# Altium schematic sheet Sheet2.SchDoc
size A; SheetNumber: 2; SheetTotal: 2
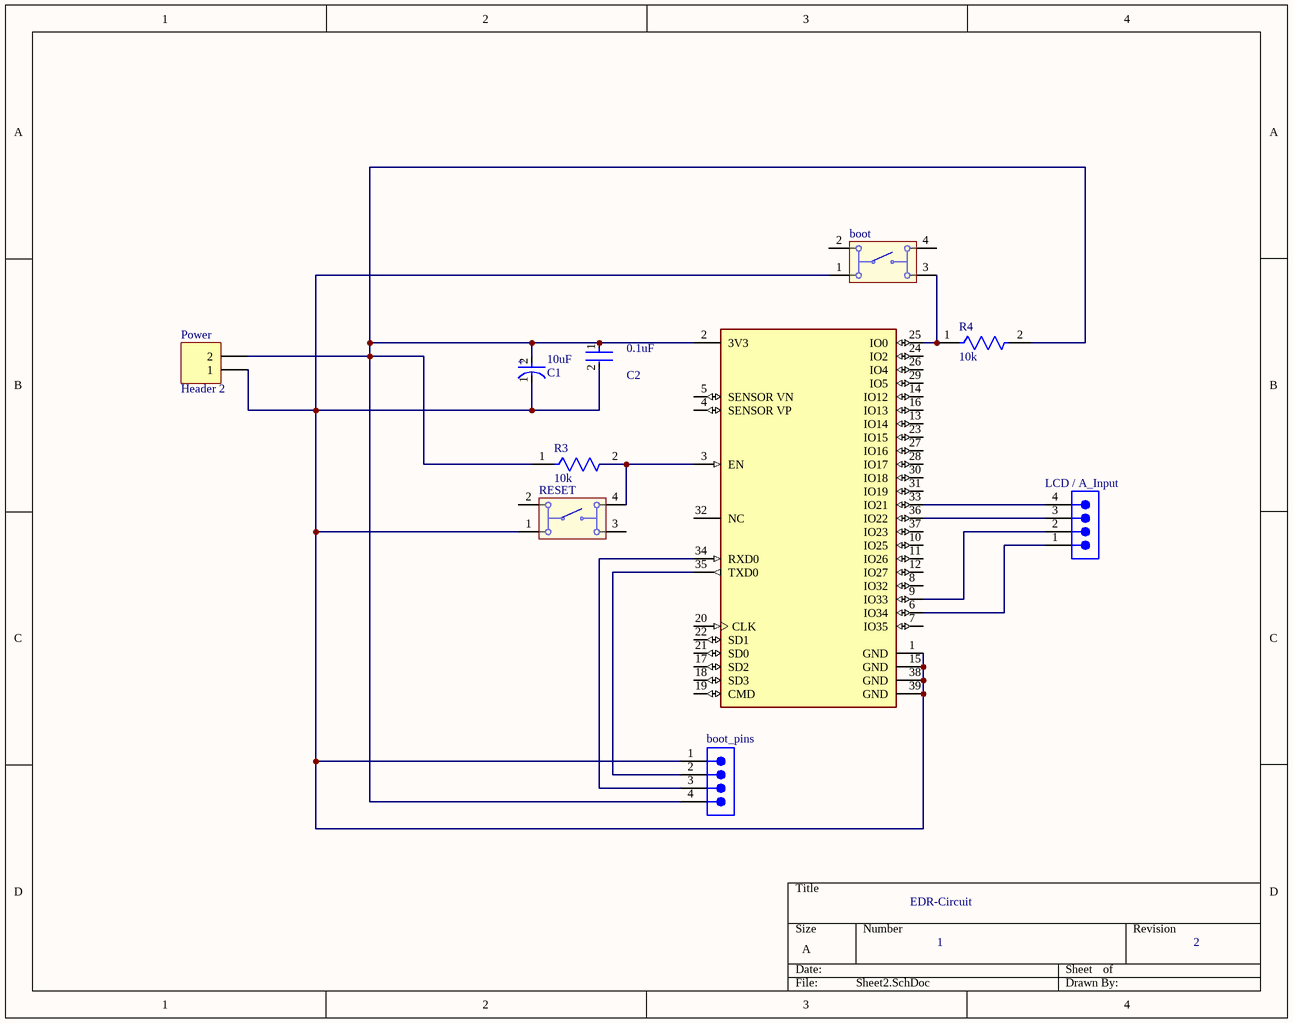
[diagram p0: Sheet2.SchDoc]

## Parts
0.1uF  C2  [FP-RCE0DB-MFG]
10uF  C1  [FP-RAD-TH-D_10_0_5-L_16_1-MFG]
boot  430471025826  [430471025826]  (value not drawn)
boot_pins  TSW-104-08-L-S  [SMTC-TSW-104-08-X-S]  (value not drawn)
esp32  ESP32-WROOM-32D  [FP-ESP32-WROOM-32D-MFG]  (value not drawn)
LCD_/_A_Input  TSW-104-08-L-S  [SMTC-TSW-104-08-X-S]  (value not drawn)
Power  Header 2  [HDR1X2]
R3  10k  [FP-MBB0207-MFG]
R4  10k  [FP-MBB0207-MFG]
RESET  430471025826  [430471025826]  (value not drawn)

## Nets
Net0.1uF_1: 0.1uF.1 10uF.2(A) boot_pins.4 esp32.2(3V3) Power.2 R3.1 R4.2
Net0.1uF_2: 0.1uF.2 10uF.1(C) boot.1 boot_pins.1 esp32.1(GND) esp32.15(GND) esp32.38(GND) esp32.39(GND) Power.1 RESET.1
Netboot_3: boot.3 esp32.25(IO0) R4.1
Netboot_pins_2: boot_pins.2 esp32.35(TXD0)
Netboot_pins_3: boot_pins.3 esp32.34(RXD0)
Netesp32_3: esp32.3(EN) R3.2 RESET.4
Netesp32_6: esp32.6(IO34) LCD_/_A_Input.1
Netesp32_9: esp32.9(IO33) LCD_/_A_Input.2
Netesp32_33: esp32.33(IO21) LCD_/_A_Input.4
Netesp32_36: esp32.36(IO22) LCD_/_A_Input.3

Not connected (* = marked no-connect by the designer): boot 2 4; esp32 4(SENSOR_VP) 5(SENSOR_VN) 7(IO35) 8(IO32) 10(IO25) 11(IO26) 12(IO27) 13(IO14) 14(IO12) 16(IO13) 17(SD2) 18(SD3) 19(CMD) 20(CLK) 21(SD0) 22(SD1) 23(IO15) 24(IO2) 26(IO4) 27(IO16) 28(IO17) 29(IO5) 30(IO18) 31(IO19) 32(NC) 37(IO23); RESET 2 3

## Notes on the sheet
- EDR-Circuit
- 1
- 2
- (in symbol CMP-05427-000979-1) +

## Library data of the parts
0.1uF = CMP-06035-048089-1: Cap Ceramic 100nF 50V X7R ±10% Radial 2.5mm +125°C Ammo Pack; Lead/Base Style: Straight; Lead Diameter: 0.5mm; Height: 3.5mm; Lead Pitch: 0.098inch; Case/Package: Radial; Height - Seated (Max): 0.138inch; Dielectric: X7R; Min Operating Temperature: -55°C; Tolerance: 10%; Max Operating Temperature: 125°C; Mount: Through Hole; Package Quantity: 2000; Voltage Rating: 50V; Lead Free: Lead Free; Capacitance: 100nF; Termination: Radial; Width: 0.098inch; Resistor Type: Ceramic; Voltage Rating (DC): 50V; Ratings: AEC-Q200; Length: 0.142inch; Packaging: Tape and Reel
10uF = CMP-05427-000979-1: Aluminum Electrolytic Capacitors (Radial Lead Type) AEC-Q200 Qualified 1000uF ±20% 10V; Leakage Current: 3uA; Lead Diameter: 0.6mm; Ripple Current: 1.05A; ESR (Equivalent Series Resistance): 68mR; Life (Hours): 3000Hour; Capacitance: 1mF; Dielectric Material: Aluminium; Packaging: Bulk; Lead Free: Lead Free; Min Operating Temperature: -55°C; Case/Package: Radial; Mount: Through Hole; Termination: Radial; Voltage: 10V; Height: 16mm; Lead Pitch: 5mm; RoHS Compliant: Yes; Voltage Rating (DC): 10V; Length: 16mm; Package Quantity: 200; Max Operating Temperature: 105°C; Ratings: AEC-Q200; Radiation Hardening: No; Contact Plating: Tin; Size: 16mm; Height - Seated (Max): 0.63inch; Diameter: 10mm; REACH SVHC: No SVHC; Series: FC; Construction: RADIAL; Voltage Rating: 10V; Tolerance: 20%; Impedance: 68mR
boot RESET = CMP-1452-00022-1: WS-TASV SMD Tact Switch 6X6 mm; Manufacturer: Wuerth Elektronik; NoPins: 04; ComponentLink1Description: Manufacturer URL; PackageReference: 430471025826; ComponentLink2Description: Datasheet; ComponentLink2URL: http://katalog.we-online.de/em/datasheet/4304x1.pdf; ComponentLink1URL: http://www.we-online.com; PartNumber: 430471025826
boot_pins LCD_/_A_Input = CMP-1024-00358-1: 0.025" SQ Post Header, Through-hole, Vertical, -55 to 125 degC, 2.54 mm Pitch, 4-Pin, Male, RoHS; Manufacturer: Samtec; Pitch: 2.54 mm; PartNumber: TSW-104-08-L-S; RoHS: True; Temperature Range: -55 to 125 degC; PackageDescription: .025[0.64] SQ. Post Terminal Strip Assembly; Orientation: Vertical; ComponentLink2URL: http://www.samtec.com/documents/webfiles/pdf/TSW_TH.PDF; ComponentLink1Description: Manufacturer URL; ComponentLink2Description: Datasheet; PackageVersion: DM, 8/1988; ComponentLink3URL: http://www.samtec.com/documents/webfiles/cpdf/TSW-XXX-XX-XXX-X-XX-XXX-MKT.pdf; Mounting Technology: Through-hole; PackageReference: TSW-104-08-X-S; ComponentLink3Description: Package Specification; ComponentLink1URL: http://www.samtec.com; DatasheetVersion: F-214
esp32 = CMP-194065-000003-1: WIFI MODULE 32MBITS SPI FLASH; Manufacturer: Espressif Systems; Max Supply Voltage: 3.6V; Nominal Supply Current: 500mA; Max Frequency: 2484MHz; Number Of Adc Channels: 16; Number Of Gpio: 32; Interface: I2C,SPI,UART,Ethernet,I2S,Other; Data Rate: 150Mbits/s; Min Supply Voltage: 3V; Bandwidth: 72MHz; Sensitivity: -98dBm; Octopart: https://octopart.com/esp32-wroom-32d-espressif+systems-91040050; Package: ESP32-WROOM-32D; ComponentLink2URL: https://www.espressif.com/sites/default/files/documentation/esp32-wroom-32d_esp32-wroom-32u_datasheet_en.pdf; Lead Free: Yes; Category: UNK; Mouser Description: Wi-Fi/BT BLE Module ESP32-D0WD, SPI Flash, UART, P; Device Class L1: Integrated Circuits (ICs); RoHS: TRUE; Temperature Range Low: -40°C; ComponentLink2Description: Datasheet; Digikey Description: WIFI MODULE 32MBITS SPI FLASH; Height: 3.2mm; Temperature: -40°C to +85°C; Manufacturer Part Number: ESP32-WROOM-32D; Device Class L3: Transceivers; Device Class L2: RF Semiconductors and Devices; Temperature Range High: +85°C; Automotive: No
Power = CMP-307-000070-1: Header, 2-Pin; Signal Integrity: Connector; Design Item ID: Header 2; Publisher: Altium Limited; Source: Miscellaneous Connectors.SchLib; LatestRevisionNote: Re-released for DXP Platform.; Pin Count: 2; Component Type: Standard; LatestRevisionDate: 17-Jul-2002
R3 R4 = CMP-02408-000035-1: RES 10K OHM 0.6W 1% AXIAL; Voltage Rating: 300V; Resistance: 10kR; Max Power Dissipation: 600mW; Temperature Coefficient: 50ppm/°C; Radiation Hardening: No; Case/Package: Conformal; Termination: Axial; Military Standard: Not; Length: 6.5mm; Voltage Rating (DC): 300V; RoHS Compliant: Yes; Number of Terminations: 2; Packaging: Tape and Reel; Features: Automotive AEC-Q200; Tolerance: 1%; Min Operating Temperature: -55°C; Power Rating: 600mW; Lead Free: Lead Free; Resistor Type: Metal Film; Construction: Cylindrical; Series: MBB 0207 - Professional; Max Operating Temperature: 155°C; Diameter: 2.5mm; Resistance Tolerance: 1%; Contact Plating: Tin; Technology: THIN FILM